# Altium schematic sheet CANopen.SchDoc
size A4
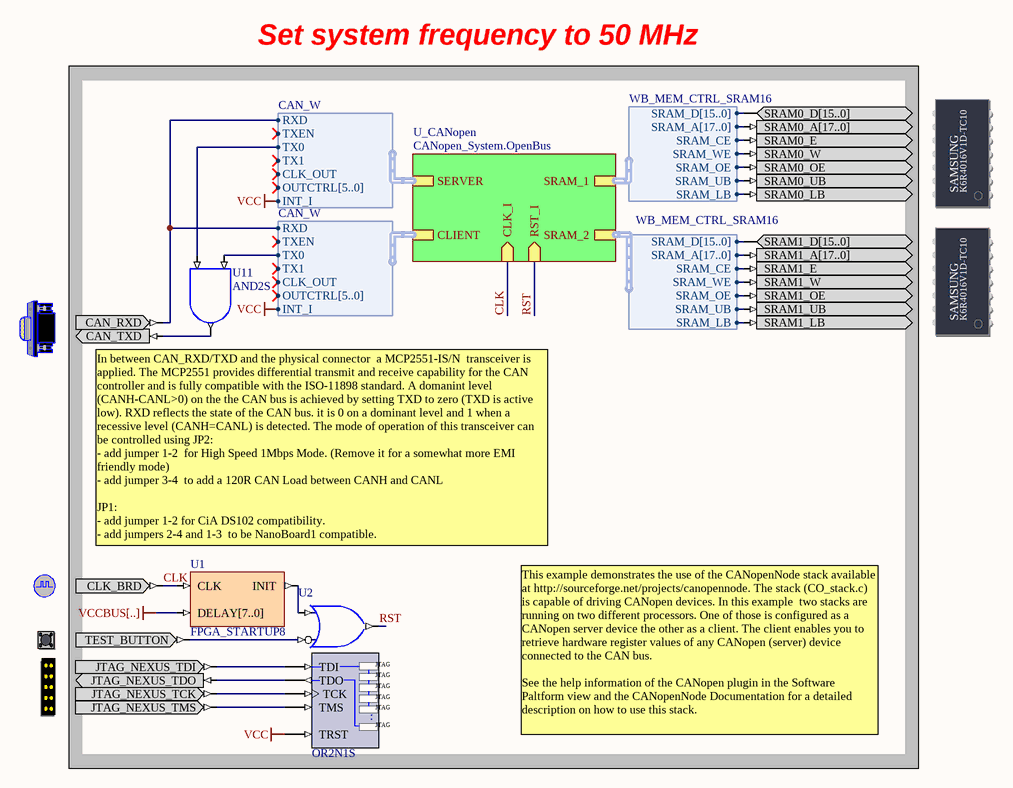
[diagram p0: CANopen.SchDoc]

## Parts
(Parts that share a designator on the sheet are numbered #1, #2 ... from top to bottom, then left to right.)
?#1  SRAM_DAUGHTER0  (value not drawn)
?#2  SRAM_DAUGHTER1  (value not drawn)
?#3  CANCNTR  (value not drawn)
?#4  CLOCK_BOARD  (value not drawn)
?#5  TEST_BUTTON  (value not drawn)
?#6  NEXUS_JTAG_CONNECTOR  (value not drawn)
NEXUS_JTAG_PORT  NEXUS_JTAG_PORT  (value not drawn)
U1  FPGA_STARTUP8
U2  OR2N1S
U11  AND2S

## Blocks framed on the sheet
Set system frequency to 50 MHz: ?#1-?#6 NEXUS_JTAG_PORT U1 U2 U11

## Sub-sheets
U_CANopen = CANopen_System.OpenBus: RST_I (in), CLK_I (in), SERVER (harness CAN_W), CLIENT (harness CAN_W), SRAM_1 (harness WB_MEM_CTRL_SRAM16), SRAM_2 (harness WB_MEM_CTRL_SRAM16)

## Harnesses
CAN_W: RXD, TXEN, TX0, TX1, CLK_OUT, OUTCTRL[5..0], INT_I
WB_MEM_CTRL_SRAM16: SRAM_D[15..0], SRAM_A[17..0], SRAM_CE, SRAM_WE, SRAM_OE, SRAM_UB, SRAM_LB

## Nets
VCC: NEXUS_JTAG_PORT.TRST ; sheet U_CANopen/CLIENT.INT_I, sheet U_CANopen/SERVER.INT_I
VCCBUS[..]: U1.DELAY[7..0]
CLK: ?#4.CLK_BRD U1.CLK ; sheet U_CANopen/CLK_I
RST: U2.O ; sheet U_CANopen/RST_I
Net?#1_SRAM0_A[17..0]: ?#1.SRAM0_A[17..0] ; sheet U_CANopen/SRAM_1.SRAM_A[17..0]
Net?#1_SRAM0_D[15..0]: ?#1.SRAM0_D[15..0] ; sheet U_CANopen/SRAM_1.SRAM_D[15..0]
Net?#1_SRAM0_E: ?#1.SRAM0_E ; sheet U_CANopen/SRAM_1.SRAM_CE
Net?#1_SRAM0_LB: ?#1.SRAM0_LB ; sheet U_CANopen/SRAM_1.SRAM_LB
Net?#1_SRAM0_OE: ?#1.SRAM0_OE ; sheet U_CANopen/SRAM_1.SRAM_OE
Net?#1_SRAM0_UB: ?#1.SRAM0_UB ; sheet U_CANopen/SRAM_1.SRAM_UB
Net?#1_SRAM0_W: ?#1.SRAM0_W ; sheet U_CANopen/SRAM_1.SRAM_WE
Net?#2_SRAM1_A[17..0]: ?#2.SRAM1_A[17..0] ; sheet U_CANopen/SRAM_2.SRAM_A[17..0]
Net?#2_SRAM1_D[15..0]: ?#2.SRAM1_D[15..0] ; sheet U_CANopen/SRAM_2.SRAM_D[15..0]
Net?#2_SRAM1_E: ?#2.SRAM1_E ; sheet U_CANopen/SRAM_2.SRAM_CE
Net?#2_SRAM1_LB: ?#2.SRAM1_LB ; sheet U_CANopen/SRAM_2.SRAM_LB
Net?#2_SRAM1_OE: ?#2.SRAM1_OE ; sheet U_CANopen/SRAM_2.SRAM_OE
Net?#2_SRAM1_UB: ?#2.SRAM1_UB ; sheet U_CANopen/SRAM_2.SRAM_UB
Net?#2_SRAM1_W: ?#2.SRAM1_W ; sheet U_CANopen/SRAM_2.SRAM_WE
Net?#3_CAN_RXD: ?#3.CAN_RXD ; sheet U_CANopen/CLIENT.RXD, sheet U_CANopen/SERVER.RXD
Net?#3_CAN_TXD: ?#3.CAN_TXD U11.O
Net?#5_TEST_BUTTON: ?#5.TEST_BUTTON U2.I0
Net?#6_JTAG_NEXUS_TCK: ?#6.JTAG_NEXUS_TCK NEXUS_JTAG_PORT.TCK
Net?#6_JTAG_NEXUS_TDI: ?#6.JTAG_NEXUS_TDI NEXUS_JTAG_PORT.TDI
Net?#6_JTAG_NEXUS_TDO: ?#6.JTAG_NEXUS_TDO NEXUS_JTAG_PORT.TDO
Net?#6_JTAG_NEXUS_TMS: ?#6.JTAG_NEXUS_TMS NEXUS_JTAG_PORT.TMS
NetU1_INIT: U1.INIT U2.I1
NetU11_I0: U11.I0 ; sheet U_CANopen/SERVER.TX0
NetU11_I1: U11.I1 ; sheet U_CANopen/CLIENT.TX0

## Notes on the sheet
- In between CAN_RXD/TXD and the physical connector  a MCP2551-IS/N  transceiver is applied. The MCP2551 provides differential transmit and receive capability for the CAN controller and is fully compatible with the ISO-11898 standard. A domanint level (CANH-CANL>0) on the the CAN bus is achieved by setting TXD to zero (TXD is active low). RXD reflects the state of the CAN bus. it is 0 on a dominant level and 1 when a recessive level (CANH=CANL) is detected. The mode of operation of this transceiver can be controlled using JP2:
  - add jumper 1-2  for High Speed 1Mbps Mode. (Remove it for a somewhat more EMI friendly mode)
  - add jumper 3-4  to add a 120R CAN Load between CANH and CANL
  JP1:
  - add jumper 1-2 for CiA DS102 compatibility.
  - add jumpers 2-4 and 1-3  to be NanoBoard1 compatible.
- This example demonstrates the use of the CANopenNode stack available at http://sourceforge.net/projects/canopennode. The stack (CO_stack.c) is capable of driving CANopen devices. In this example  two stacks are running on two different processors. One of those is configured as a CANopen server device the other as a client. The client enables you to retrieve hardware register values of any CANopen (server) device connected to the CAN bus.
  See the help information of the CANopen plugin in the Software Paltform view and the CANopenNode Documentation for a detailed description on how to use this stack.
- Sheet Title
- Project Title
- Size:
- Date:
- A4
- Assy:
- Time:
- Sheet
- Revision:
- of
- File:
- (in symbol NEXUS_JTAG_PORT) .
- (in symbol SRAM_DAUGHTER0) SAMSUNG; K6R4016V1D-TC10
- (in symbol SRAM_DAUGHTER1) SAMSUNG; K6R4016V1D-TC10

## Library data of the parts
?#1 = SRAM_DAUGHTER0: Free Static RAM - Daughterboard; PortComponent: True; Published: 14-May-2007; Publisher: Altium Limited; HelpURL: TR0143 NanoBoard Technical Reference Manual - NB2.pdf#page=24
?#2 = SRAM_DAUGHTER1: Free Static RAM - Daughterboard; PortComponent: True; Published: 14-May-2007; Publisher: Altium Limited; HelpURL: TR0143 NanoBoard Technical Reference Manual - NB2.pdf#page=24
?#3 = CANCNTR: CAN Bus Connector; PortComponent: True; Published: 19-Nov-2003; Publisher: Altium Limited; HelpURL: TR0143 NanoBoard Technical Reference Manual - NB2.pdf#page=39
?#4 = CLOCK_BOARD: Global System Clock Supply; PortComponent: True; Published: 19-Nov-2003; Publisher: Altium Limited; HelpURL: TR0143 Technical Reference Manual for Altium's Desktop NanoBoard NB2DSK01.pdf#page=41; UseInDSF: True
?#5 = TEST_BUTTON: Test / Reset Button; PortComponent: True; Published: 19-Nov-2003; Publisher: Altium Limited; HelpURL: TR0143 Technical Reference Manual for Altium's Desktop NanoBoard NB2DSK01.pdf#page=53
?#6 = NEXUS_JTAG_CONNECTOR: JTAG Port; PortComponent: True; Published: 19-Nov-2003; Publisher: Altium Limited; HelpURL: TR0102 NanoBoard Technical Reference Manual - NB1.pdf#page=33
NEXUS_JTAG_PORT = NEXUS_JTAG_PORT: Soft Nexus-Chain Connector; NEXUS_JTAG_CONNECTOR: True; FunctionalClass: JTAG; Published: 29-Jan-2004; Publisher: Altium Limited; LastRevisionNo: 1.00.00; HelpURL: CR0118 FPGA Generic Library Guide.pdf#page=405
U1 = FPGA_STARTUP8: FPGA Startup With 8 Bit Delay; Published: 9-Dec-2004; Publisher: Altium Limited; HelpURL: CR0119 FPGA_STARTUPx Powerup Delay Unit.pdf; LastRevisionNo: 1.00.00; ComponentLink1Description: Core &Resource Usage; ComponentLink1URL: CR0139 FPGA Peripheral Resource Usage.pdf#page=11
U2 = OR2N1S: 2-Input OR Gate with Active Low A Input, Single Pin Version; XilinxEquivalent: OR2B1; FunctionalClass: Logic Primitive; PortSize: 2; ArchiveName: GENERIC; VHDLIB_SIM: GENERIC_LIB; Published: 29-Jan-2004; Publisher: Altium Limited; LastRevisionNo: 1.00.00; HelpURL: CR0118 FPGA Generic Library Guide.pdf#page=410; ComponentLink1URL: CR0136 FPGA Logic Primitive Resource Usage.pdf#page=187; ComponentLink1Description: Core &Resource Usage; SubClass: OR; PortStyle: Single Pin Version
U11 = AND2S: 2-Input AND Gate, Single Pin Version; XilinxEquivalent: AND2; FunctionalClass: Logic Primitive; PortSize: 2; ArchiveName: GENERIC; VHDLIB_SIM: GENERIC_LIB; Published: 29-Jan-2004; Publisher: Altium Limited; LastRevisionNo: 1.00.00; HelpURL: CR0118 FPGA Generic Library Guide.pdf#page=114; ComponentLink1URL: CR0136 FPGA Logic Primitive Resource Usage.pdf#page=13; ComponentLink1Description: Core &Resource Usage; SubClass: AND; PortStyle: Single Pin Version